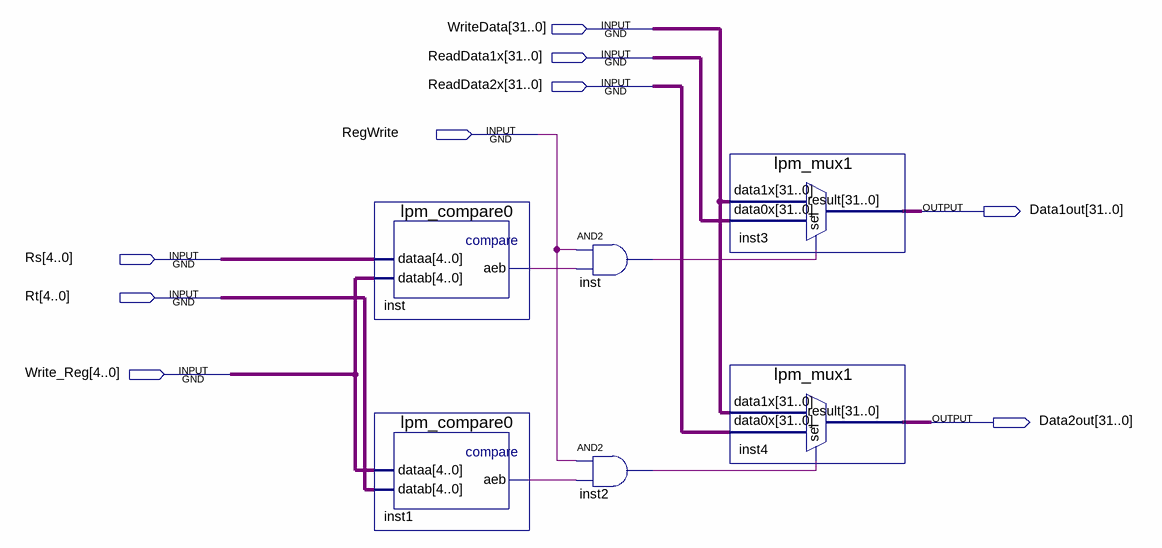
[diagram p0: schematic sheet]
// Quartus schematic WB_Forward_Equal.bdf as structural Verilog: 6 symbols, 9 pins
module WB_Forward_Equal (
  input  [31:0] WriteData,
  input  [31:0] ReadData1x,
  input  [31:0] ReadData2x,
  input  RegWrite,
  input  [4:0] Rs,
  input  [4:0] Rt,
  input  [4:0] Write_Reg,
  output [31:0] Data1out,
  output [31:0] Data2out
);

  wire inst1_aeb, inst2_out, inst_aeb, inst_out;

  lpm_compare0 inst (.dataa(Rs), .datab(Write_Reg), .aeb(inst_aeb));
  lpm_compare0 inst1 (.dataa(Write_Reg), .datab(Rt), .aeb(inst1_aeb));
  and inst_dup2 (inst_out, RegWrite, inst_aeb);
  and inst2 (inst2_out, RegWrite, inst1_aeb);
  lpm_mux1 inst3 (.data1x(WriteData), .data0x(ReadData1x), .sel(inst_out), .result(Data1out));
  lpm_mux1 inst4 (.data1x(WriteData), .data0x(ReadData2x), .sel(inst2_out), .result(Data2out));
endmodule
